# EAGLE design MPS+ADXL (EAGLE 9.5.1)
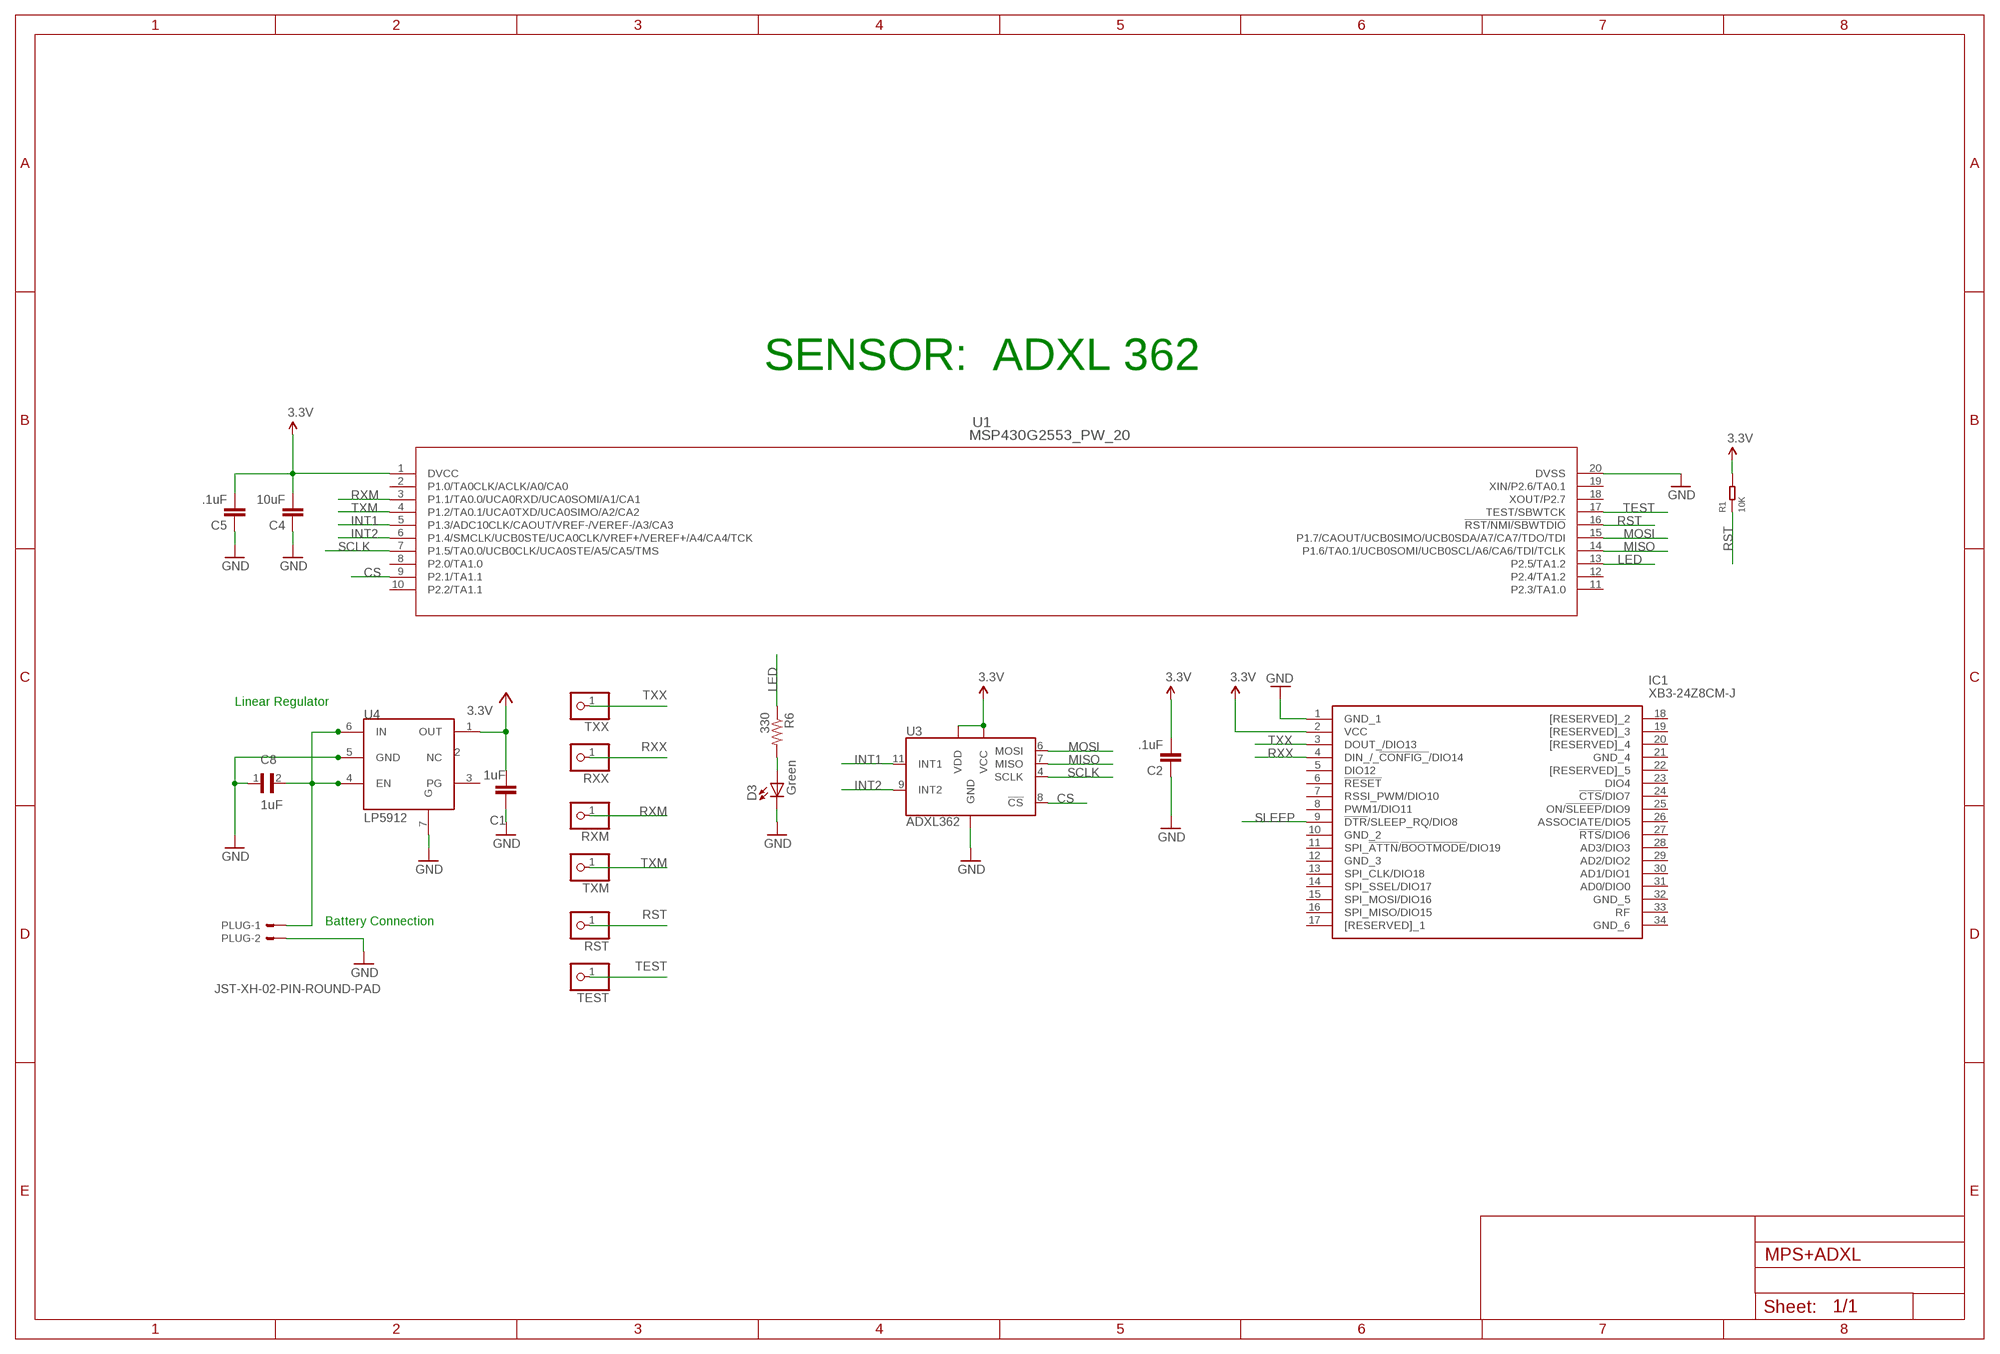
[diagram p0: schematic, sheet 1]

## Parts
C1  1uF  C-EUC0603  [C0603]
C2  .1uF  0.1UF-25V(+80/-20%)(0603)  [0603-CAP]
C4  10uF  0.1UF-25V(+80/-20%)(0603)  [0603-CAP]
C5  .1uF  0.1UF-25V(+80/-20%)(0603)  [0603-CAP]
C8  1uF  0402YD105MAT2A  [CAPC1005X71N]
D3  Green  LED  [0603-LED-ALT1]
IC1  XB3-24Z8CM-J  [XB324Z8CMJ]
PLUG  JST-XH-02-PIN-ROUND-PAD  [JST-XH-02-PACKAGE-ROUND-PAD]
R1  10K  SMD-RES-4.7K-5%-1/16W(0402)  [R0402]
R6  330  RESISTOR0603-RES  [0603-RES]
RST  PINHD-1X1  [1X01]
RXM  PINHD-1X1  [1X01]
RXX  PINHD-1X1  [1X01]
TEST  PINHD-1X1  [1X01]
TXM  PINHD-1X1  [1X01]
TXX  PINHD-1X1  [1X01]
U1  MSP430G2553_PW_20  [PW20]
U3  ADXL362  [TFLGA-16/3.3MMX3.1MM]
U4  LP5912  [LP5912]

## Nets
3.3V: C2.2 C4.2 C5.2 IC1.2(VCC) R1.2 U1.1(DVCC) U3.1(VDD) U3.14(VCC)
BATTERY: C8.2 PLUG.1 U4.4(EN) U4.6(IN)
CS: U1.9(P2.1/TA1.1) U3.8(!CS)
GND [vcc]: C1.1 C2.1 C4.1 C5.1 C8.1 D3.C IC1.1(GND_1) PLUG.2 U1.20(DVSS) U3.12(GND) U3.13(GND) U3.16(GND) U4.5(GND) U4.7(G)
INT1: U1.5(P1.3/ADC10CLK/CAOUT/VREF-/VEREF-/A3/CA3) U3.11(INT1)
INT2: U1.6(P1.4/SMCLK/UCB0STE/UCA0CLK/VREF+/VEREF+/A4/CA4/TCK) U3.9(INT2)
LED: R6.1 U1.13(P2.5/TA1.2)
MISO: U1.14(P1.6/TA0.1/UCB0SOMI/UCB0SCL/A6/CA6/TDI/TCLK) U3.7(MISO)
MOSI: U1.15(P1.7/CAOUT/UCB0SIMO/UCB0SDA/A7/CA7/TDO/TDI) U3.6(MOSI)
N$7: D3.A R6.2
RST: R1.1 RST.1 U1.16(!RST/NMI/SBWTDIO)
RXM: RXM.1 U1.3(P1.1/TA0.0/UCA0RXD/UCA0SOMI/A1/CA1)
RXX: IC1.4(DIN_/_!CONFIG_!/DIO14) RXX.1
SCLK: U1.7(P1.5/TA0.0/UCB0CLK/UCA0STE/A5/CA5/TMS) U3.4(SCLK)
SLEEP: IC1.9(!DTR!/SLEEP_RQ/DIO8)
TEST: TEST.1 U1.17(TEST/SBWTCK)
TXM: TXM.1 U1.4(P1.2/TA0.1/UCA0TXD/UCA0SIMO/A2/CA2)
TXX: IC1.3(DOUT_/DIO13) TXX.1
VCC: C1.2 U4.1(OUT) ; supply symbol labelled 3.3V
Unconnected: IC1.5(DIO12) IC1.6(!RESET) IC1.7(RSSI_PWM/DIO10) IC1.8(PWM1/DIO11) IC1.10(GND_2) IC1.11(SPI_!ATTN!/!BOOTMODE!/DIO19) IC1.12(GND_3) IC1.13(SPI_CLK/DIO18) IC1.14(SPI_SSEL/DIO17) IC1.15(SPI_MOSI/DIO16) IC1.16(SPI_MISO/DIO15) IC1.17([RESERVED]_1) IC1.18([RESERVED]_2) IC1.19([RESERVED]_3) IC1.20([RESERVED]_4) IC1.21(GND_4) IC1.22([RESERVED]_5) IC1.23(DIO4) IC1.24(!CTS!/DIO7) IC1.25(ON/!SLEEP!/DIO9) IC1.26(ASSOCIATE/DIO5) IC1.27(!RTS!/DIO6) IC1.28(AD3/DIO3) IC1.29(AD2/DIO2) IC1.30(AD1/DIO1) IC1.31(AD0/DIO0) IC1.32(GND_5) IC1.33(RF) IC1.34(GND_6) U1.2(P1.0/TA0CLK/ACLK/A0/CA0) U1.8(P2.0/TA1.0) U1.10(P2.2/TA1.1) U1.11(P2.3/TA1.0) U1.12(P2.4/TA1.2) U1.18(XOUT/P2.7) U1.19(XIN/P2.6/TA0.1) U4.2(NC) U4.3(PG)

## Notes on the sheet
- SENSOR:  ADXL 362
- Linear Regulator
- Battery Connection

## Library data of the parts
C1 = rcl:C-EU: CAPACITOR, European symbol; SPICEPREFIX: C
C2 C4 C5 = SparkFun-Capacitors:0.1UF-25V(+80/-20%)(0603): CAP-00810 Ceramic Standard decoupling cap; PROD_ID: CAP-00810; VALUE: 0.1uF
C8 = Capacitor1uF:0402YD105MAT2A: CAP 1UF 16VDC X5R 20% SMD 0402; AVAILABILITY: Unavailable; DESCRIPTION: Cap 1uf 16vdc X5r 20% Smd 0402; MF: AVX; MP: 0402YD105MAT2A; PACKAGE: 1005 AVX; PRICE: None
D3 = Testing:LED: LEDs Standard schematic elements and footprints for 5mm, 3mm, 1206, and 0603 sized LEDs. 5mm - Spark Fun Electronics SKU : COM-00529 (and others)
IC1 = XB3-24Z8CM-J:XB3-24Z8CM-J: Zigbee Modules (802.15.4) XBee3 ,2.4 Ghz ZB 3.0, Chip Ant, MMT Source: Datasheet <https://www.digi.com/resources/documentation/digidocs/pdfs/90001543.pdf>; DESCRIPTION: Zigbee Modules (802.15.4) XBee3 ,2.4 Ghz ZB 3.0, Chip Ant, MMT; HEIGHT: 4mm; MANUFACTURER_NAME: Digi International; MANUFACTURER_PART_NUMBER: XB3-24Z8CM-J; MOUSER_PART_NUMBER: 888-XB3-24Z8CM-J; MOUSER_PRICE-STOCK: https://www.mouser.com/Search/Refine.aspx?Keyword=888-XB3-24Z8CM-J
PLUG = Rembrandt Electronics - JST XH Connectors v1-0:JST-XH-02-PIN: JST XH Connector 2 Pin Wire to board connector. Pitch: 2,54 mm, (0.100") Number of pins: 2 Created by Rembrandt Electronics www.rembrandtelectronics.com
R1 = RES-4.7K-SMD-5_-1_16W_0402_:SMD-RES-4.7K-5%-1/16W(0402): 301010010; AVAILABILITY: Unavailable; DESCRIPTION: Res Thick Film 0402 4.7K Ohm 5% 0.063W_1/16W_ ?100ppm/C Molded SMD Paper T/R; MF: Yageo; MP: RC0402JR074K7L; PACKAGE: 0402 Yageo; PRICE: None
R6 = SparkFun:RESISTOR: Resistor Basic schematic elements and footprints for 0603, 1206, and PTH resistors.
RST RXM RXX TEST TXM TXX = pinhead:PINHD-1X1: PIN HEADER
U1 = MSP430G2553_PW_20:MSP430G2553_PW_20; BUILT_BY: EMA_UL_Team; MANUFACTURER: Texas Instruments; MANUFACTURER_PART_NUMBER: MSP430G2553_PW_20; VENDOR: Texas Instruments
U3 = ADXL362:ADXL362: IC ACCEL DIG LO PWR 3AX 16LGA; AVAILABILITY: Unavailable; DESCRIPTION: Accelerometer X, Y, Z Axis ±2g, 4g, 8g 6.25Hz ~ 400Hz 16-LGA _3x3.25_; MF: Analog Devices; MP: ADXL362; PACKAGE: LGA-16 Analog Devices; PRICE: None
U4 = electronic-labs:LP5912

## Net classes
0 default: width 0.203 mm
1 vcc: width 0.254 mm

## Board
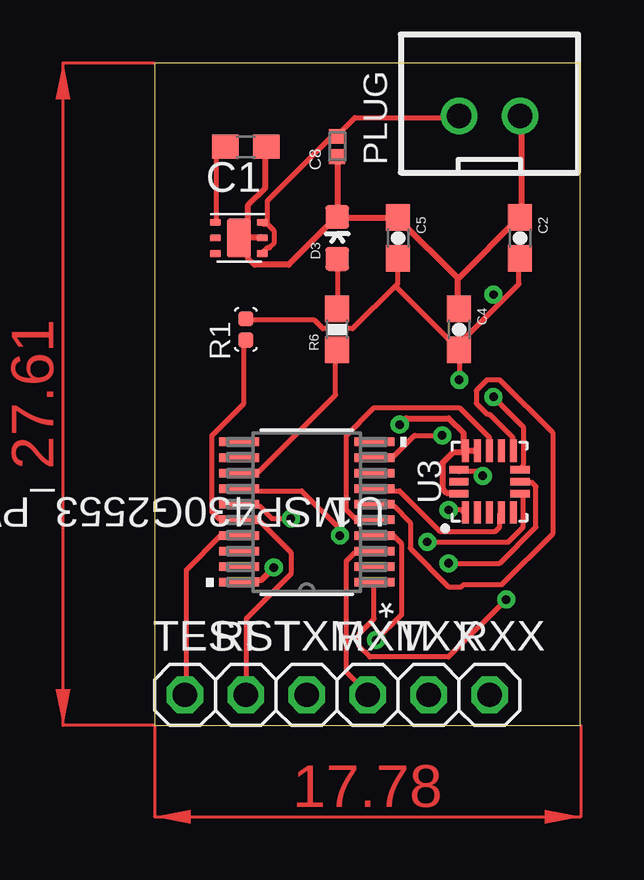
[diagram p1: board, top side]
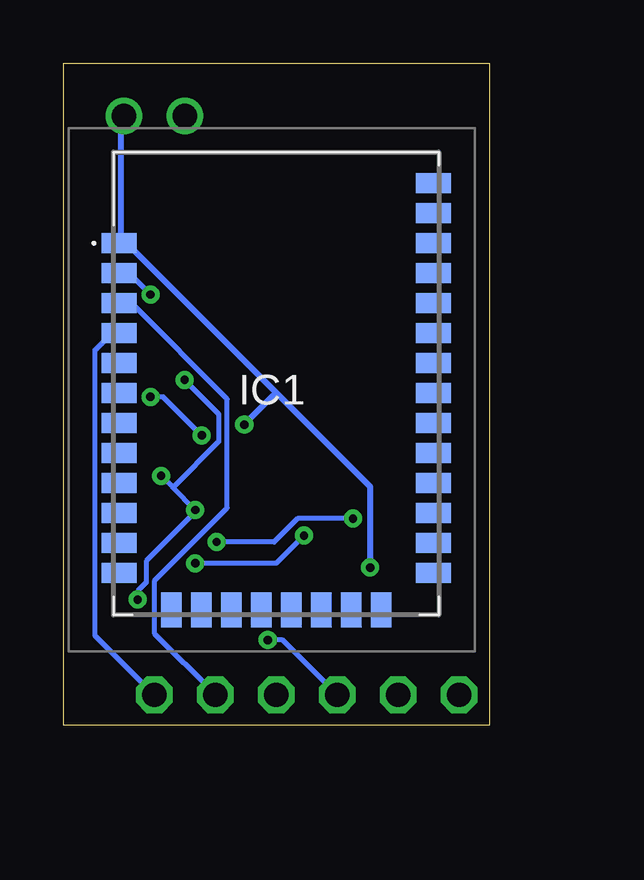
[diagram p2: board, bottom side, seen from below]

Size 17.76 x 27.61 mm. Coordinates in mm from the lower left corner, seen from the top.
Outline: 0,0 17.76,0 17.76,27.61 0,27.61 0,0
Copper layers (1*16): Top 0.035mm / dielectric 1.5mm / Bottom 0.035mm
Design rules "default": minimum track width 6mil, minimum drill 0.35mm, track to track 6mil, track to pad 6mil, pad to pad 6mil, via to via 6mil, smd to smd 6mil, copper to edge 40mil, drill to drill 6mil, minimum pad ring 10mil, minimum via ring 8mil, stop-mask expansion 4mil, vias tented up to drill 0mil, thermal gap 10mil

### Footprints (pad centres in the part's own frame; a part is rotated, then mirrored left to right if it is on the bottom)
C0603 = smd 1.1 x 1: 1 -0.85,0; 2 0.85,0
0603-CAP = smd 1.1 x 1: 1 -0.85,0; 2 0.85,0
CAPC1005X71N = smd 0.62 x 0.67: 1 -0.425,0; 2 0.425,0
0603-LED-ALT1 = smd 1 x 1: A 0,-0.877; C 0,0.877
XB324Z8CMJ = smd 1.448 x 0.838: 1 -6.553,13.75; 2 -6.553,12.5; 3 -6.553,11.25; 4 -6.553,10; 5 -6.553,8.75; 6 -6.553,7.5; 7 -6.553,6.25; 8 -6.553,5; 9 -6.553,3.75; 10 -6.553,2.5; 11 -6.553,1.25; 12 -6.553,0; 21 6.553,0; 22 6.553,1.25; 23 6.553,2.5; 24 6.553,3.75; 25 6.553,5; 26 6.553,6.25; 27 6.553,7.5; 28 6.553,8.75; 29 6.553,10; 30 6.553,11.25; 31 6.553,12.5; 32 6.553,13.75; 33 6.553,15; 34 6.553,16.25 | smd 0.838 x 1.448: 13 -4.375,-1.537; 14 -3.125,-1.537; 15 -1.875,-1.537; 16 -0.625,-1.537; 17 0.625,-1.537; 18 1.875,-1.537; 19 3.125,-1.537; 20 4.375,-1.537
JST-XH-02-PACKAGE-ROUND-PAD = drill 1.016: 1 -1.27,0; 2 1.27,0
R0402 = smd 0.635 x 0.635: 1 0,0.445; 2 0,-0.445
0603-RES = smd 1.1 x 1: 1 -0.85,0; 2 0.85,0
1X01 = drill 1.016 octagon: 1 0,0
PW20 = smd 1.676 x 0.356: 1 -2.819,2.925; 2 -2.819,2.275; 3 -2.819,1.625; 4 -2.819,0.975; 5 -2.819,0.325; 6 -2.819,-0.325; 7 -2.819,-0.975; 8 -2.819,-1.625; 9 -2.819,-2.275; 10 -2.819,-2.925; 11 2.819,-2.925; 12 2.819,-2.275; 13 2.819,-1.625; 14 2.819,-0.975; 15 2.819,-0.325; 16 2.819,0.325; 17 2.819,0.975; 18 2.819,1.625; 19 2.819,2.275; 20 2.819,2.925
TFLGA-16/3.3MMX3.1MM = smd 0.925 x 0.3: 1 -1.288,1; 2 -1.288,0.5; 3 -1.288,0; 4 -1.288,-0.5; 5 -1.288,-1; 9 1.288,-1; 10 1.288,-0.5; 11 1.288,0; 12 1.288,0.5; 13 1.288,1 | smd 0.3 x 0.8: 6 -0.5,-1.275; 7 0,-1.275; 8 0.5,-1.275; 14 0.5,1.275; 15 0,1.275; 16 -0.5,1.275
LP5912 = smd 0.45 x 0.3: 1 0,0.65; 2 0,0; 3 0,-0.65; 4 1.95,-0.65; 5 1.95,0; 6 1.95,0.65 | smd 1 x 1.6: 7 0.975,0

### Placement (x,y rotation side)
C1  3.81,24.13 180 top
C2  15.24,20.32 270 top
C4  12.7,16.51 270 top
C5  10.16,20.32 270 top
C8  7.62,24.13 90 top
D3  7.62,20.32 0 top
IC1  8.89,6.35 0 bottom
PLUG  13.97,25.4 0 top
R1  3.81,16.51 180 top
R6  7.62,16.51 90 top
RST  3.81,1.27 0 top
RXM  8.89,1.27 0 top
RXX  13.97,1.27 0 top
TEST  1.27,1.27 0 top
TXM  6.35,1.27 0 top
TXX  11.43,1.27 0 top
U1  6.35,8.89 180 top
U3  13.97,10.16 90 top
U4  2.54,20.32 0 top

### Tracks (layer width: path | path; a pad name or v marks a point on that pad's centre or on a via)
3.3V  (via drill 0.35)
  Top 0.203: v13.69,10.4 13.51,10.58 12.71,10.58 U3.14 | v12.27,8.98 12.8,8.98 12.89,8.89 U3.1 | v14.67,5.25 12.27,2.85 8.98,2.85 8.53,3.29 8.53,3.82 9.16,4.45 9.16,5.96 U1.1 | 10.05,18.31 10.13,18.4 10.13,19.47 C5.2 | 10.05,18.31 8.27,16.54 7.02,16.54 6.67,16.89 3.82,16.89 R1.2 | 10.05,18.31 12.62,15.73 C4.2 | 14.45,17.65 12.62,15.82 C4.2 | 14.45,17.65 15.2,18.4 15.2,19.47 C2.2 | 14.45,17.65 v14.13,17.96 | v12.71,14.4 12.71,15.56 C4.2
  Bottom 0.203: 13.2,9.91 v12.27,8.98 12.27,8.89 14.31,6.84 14.31,5.96 14.67,5.6 v14.67,5.25 | 13.2,9.91 v13.69,10.4 | v14.13,17.96 15.02,18.85 15.38,18.85 IC1.2 | 13.2,9.91 11.29,11.82 11.29,12.98 v12.71,14.4
BATTERY
  Top 0.203: U4.4 4.53,19.74 4.71,19.91 4.8,19.91 4.98,20.09 4.98,20.62 4.71,20.89 4.53,20.89 U4.6 4.71,20.98 4.71,21.87 7.38,24.54 7.56,24.54 C8.2 7.64,24.62 8.36,25.34 12.62,25.34 PLUG.1
CS  (via drill 0.35)
  Top 0.203: v14.13,13.69 15.38,12.45 15.38,10.85 15.29,10.76 15.29,10.67 U3.8 | v12,12.09 10.85,12.09 9.96,11.2 9.25,11.2 U1.9
  Bottom 0.203: v14.13,13.69 13.6,13.69 v12,12.09
GND  (via drill 0.35)
  Top 0.254: U4.5 4.45,20.36 3.56,20.36 U4.7 | C1.1 4.62,24.09 4.62,22.4 3.91,21.69 3.91,20.45 U4.7 | C8.1 7.64,23.65 7.64,21.25 D3.C | D3.C 7.73,21.16 10.13,21.16 C5.1 10.22,21.07 12.62,18.67 | 12.62,18.67 12.62,17.42 C4.1 | 12.62,18.67 12.71,18.67 15.2,21.16 C2.1 15.29,21.25 15.29,25.34 PLUG.2 | U4.7 3.91,20.27 3.91,19.47 4.18,19.2 5.6,19.2 7.56,21.16 D3.C | U3.16 12.62,9.69 12.18,9.69 12,9.87 12,10.94 12.45,11.38 12.89,11.38 U3.13 | U3.12 13.42,11.47 13.07,11.47 U3.13 | v4.98,6.58 4.45,6.04 3.56,6.04 U1.20 | v10.22,12.54 10.49,12.8 12.27,12.8 12.89,12.18 12.89,11.56 U3.13
  Bottom 0.254: PLUG.2 15.29,25.34 15.38,25.25 15.38,20.18 IC1.1 15.29,20.27 8.89,13.87 | v4.98,6.58 4.98,9.96 8.89,13.87 | 8.89,13.87 v10.22,12.54
INT1
  Top 0.203: U3.11 13.96,11.47 13.96,12 12.71,13.25 9.16,13.25 8,12.09 8,8.98 8.36,8.62 9.16,8.62 U1.5
INT2
  Top 0.203: U3.9 14.94,11.47 14.94,12 13.96,12.98 13.87,12.98 13.42,13.42 13.42,13.96 13.87,14.4 14.4,14.4 16.62,12.18 16.62,8 14.49,5.87 12.89,5.87 12.8,5.78 12.27,5.78 10.67,7.38 10.67,8.45 9.96,9.16 9.25,9.16 U1.6
LED
  Top 0.203: R6.1 7.56,15.65 7.56,13.78 4.36,10.58 3.56,10.58 U1.13
MISO  (via drill 0.35)
  Top 0.203: v12.27,6.76 14.4,6.76 15.91,8.27 15.91,9.96 15.73,10.13 15.29,10.13 U3.7 | v7.73,7.91 7.73,8.18 6.13,9.78 3.56,9.78 U1.14
  Bottom 0.203: v12.27,6.76 8.89,6.76 v7.73,7.91
MOSI  (via drill 0.35)
  Top 0.203: v11.38,7.64 14.76,7.64 15.38,8.27 15.38,9.51 15.29,9.6 U3.6 | v5.69,8.62 4.89,8.62 4.36,9.16 3.56,9.16 U1.15
  Bottom 0.203: v11.38,7.64 8.98,7.64 8,8.62 v5.69,8.62
N$7
  Top 0.203: D3.A 7.64,19.38 7.64,17.42 R6.2
RST
  Top 0.203: R1.1 3.73,16 3.73,13.42 2.4,12.09 2.4,8.89 2.67,8.62 3.47,8.62 U1.16 3.56,8.53 4.36,8.53 5.69,7.2 5.69,6.31 3.82,4.45 3.82,1.33 RST.1
RXM
  Top 0.203: U1.3 9.16,7.2 8.36,7.2 8,6.84 8,2.22 8.89,1.33 RXM.1
RXX
  Bottom 0.203: IC1.4 15.47,16.27 15.82,16.27 16.45,15.65 16.45,3.73 14.05,1.33 RXX.1
SCLK
  Top 0.203: U3.4 14.4,8.8 14.4,8.27 14.22,8.09 11.91,8.09 10.22,9.78 9.25,9.78 U1.7
TEST
  Top 0.203: U1.17 3.47,7.91 2.76,7.91 1.33,6.49 1.33,1.33 TEST.1
TXM  (via drill 0.35)
  Top 0.203: v9.25,3.56 10.31,4.62 10.31,7.56 9.96,7.91 9.25,7.91 U1.4
  Bottom 0.203: v9.25,3.56 8.62,3.56 6.4,1.33 TXM.1
TXX
  Bottom 0.203: IC1.3 15.38,17.51 14.85,17.51 10.94,13.6 10.94,9.07 13.96,6.04 13.96,3.82 11.47,1.33 TXX.1
VCC
  Top 0.203: U4.1 2.58,20.98 2.58,23.74 2.93,24.09 C1.2
(copper drawn outside any net)
  shapes: Top area x2